# EAGLE design sensor_interface_1.1.0 (EAGLE 8.1.1)
DESCRIPTION: microOBD 200 OBD-II Module; HW_REV: 1.4; PCB_REV: C; PCB_SPEC1: Layer Count: 4; PCB_SPEC2: Size: 1.3" x 0.59"; PCB_SPEC3: Finish Thickness: 0.049" - 0.052"; PCB_SPEC4: Copper Weight: 1oz; TITLE: STM1120
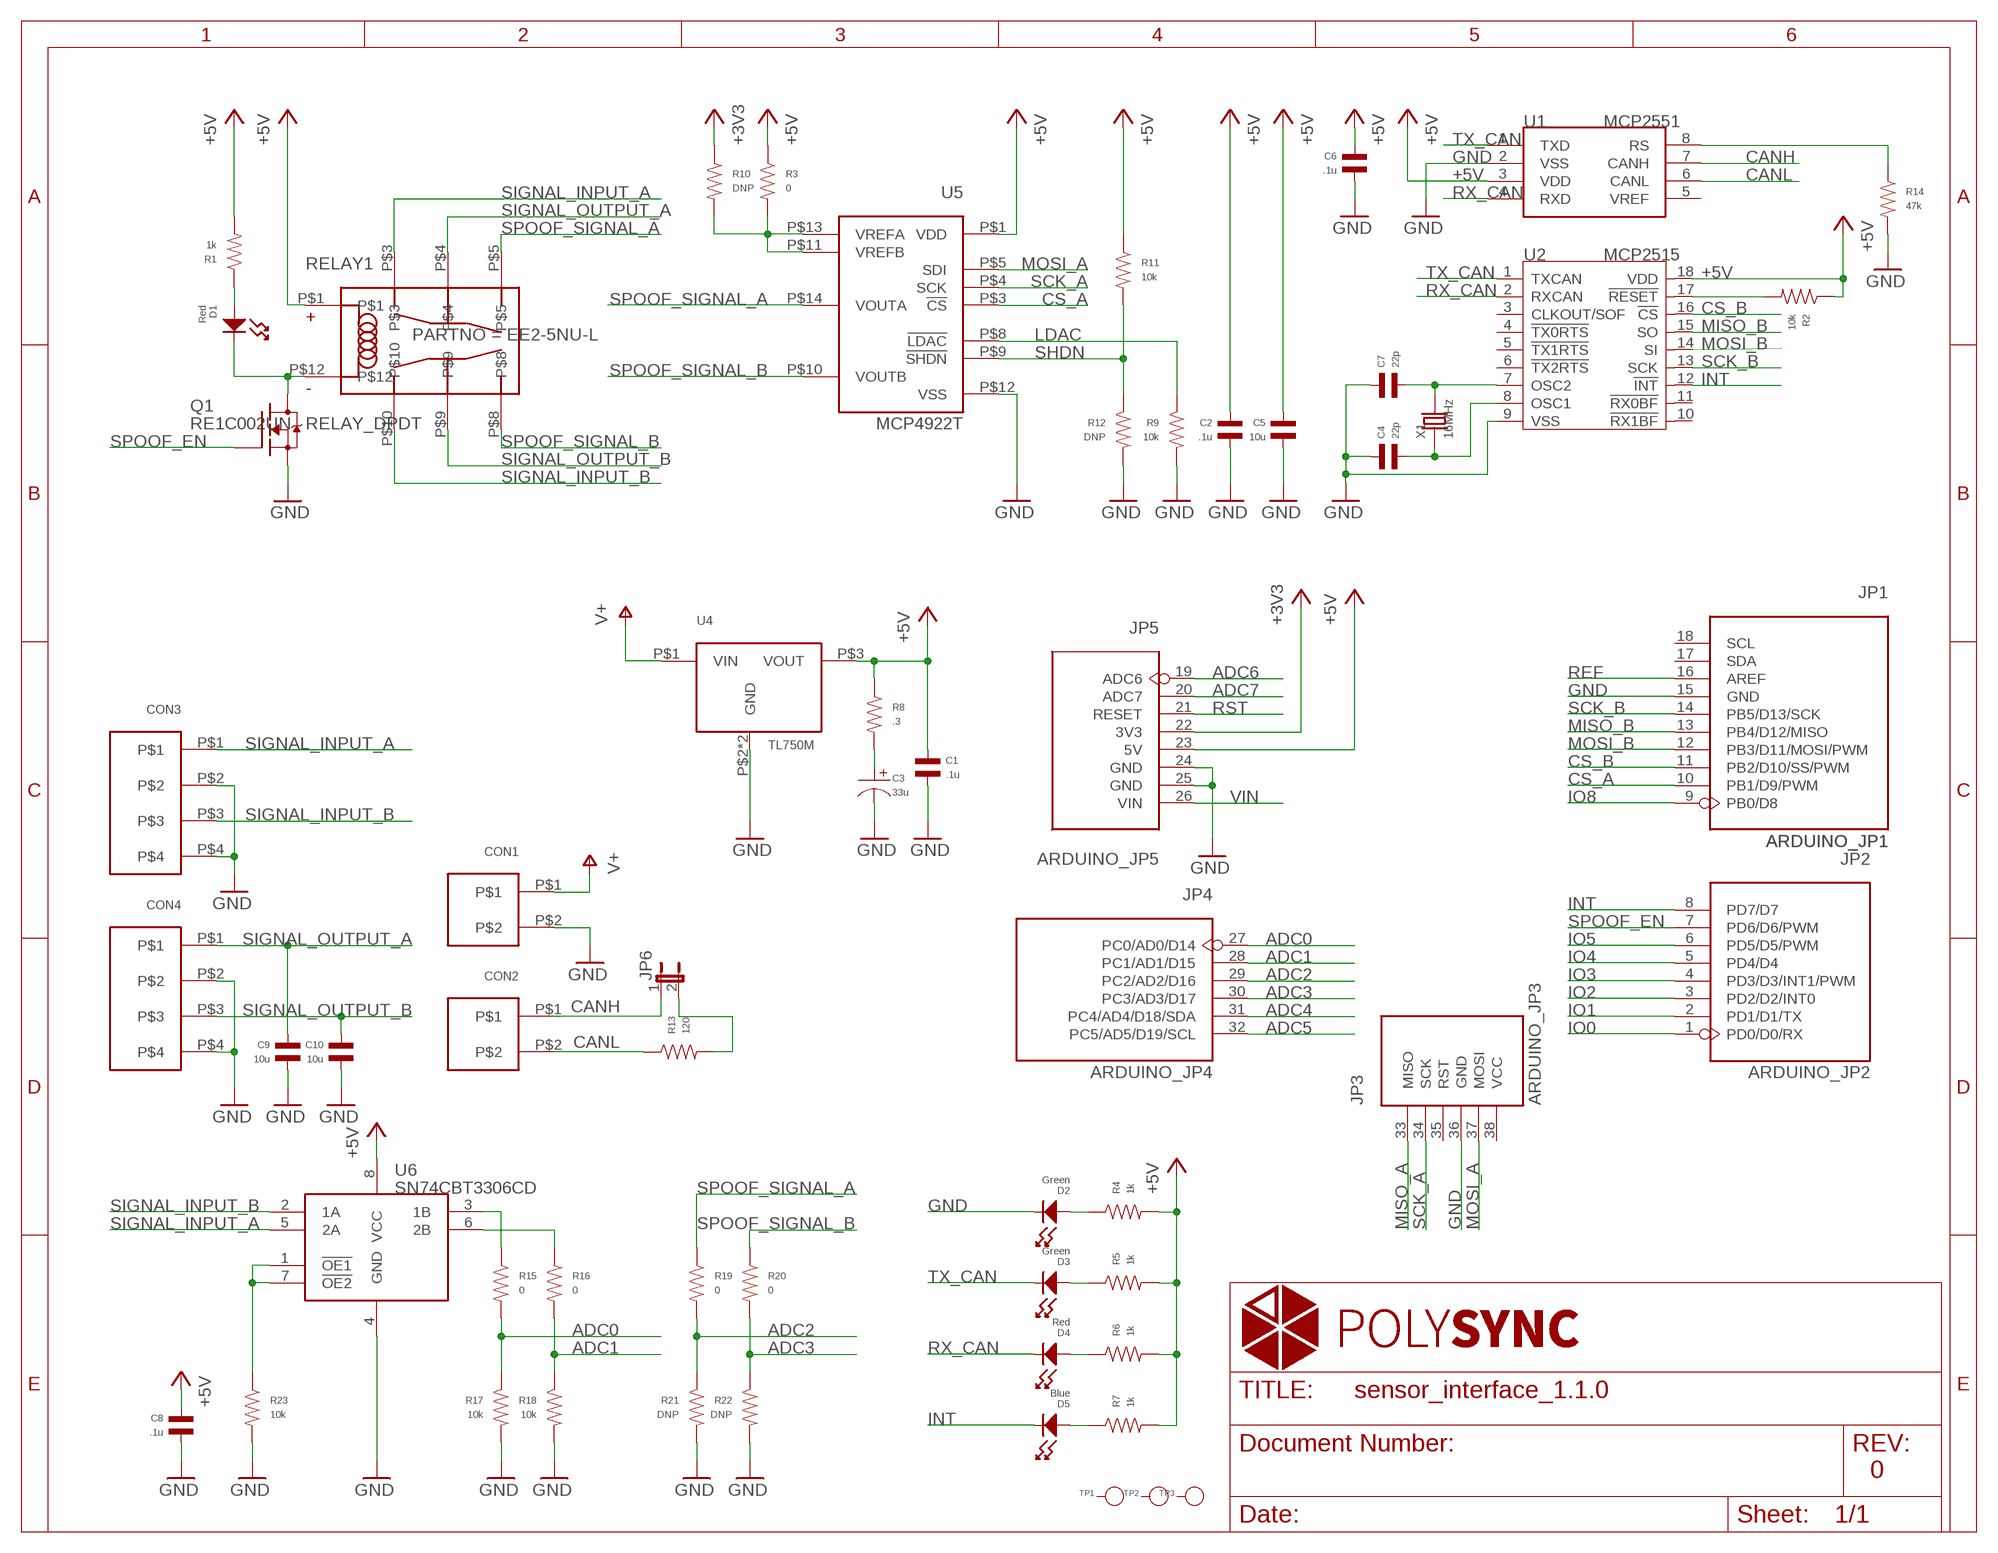
[diagram p0: schematic, sheet 1]

## Parts
C1  .1u  CAPACITOR_NP_0402  [C0402]
C2  .1u  CAPACITOR_NP_0402  [C0402]
C3  33u  CAPACITOR_P  [CP1206]
C4  22p  CAPACITOR_NP_0402  [C0402]
C5  10u  CAPACITOR_NP_0805  [C0805]
C6  .1u  CAPACITOR_NP_0402  [C0402]
C7  22p  CAPACITOR_NP_0402  [C0402]
C8  .1u  CAPACITOR_NP_0402  [C0402]
C9  10u  CAPACITOR_NP_0805  [C0805]
C10  10u  CAPACITOR_NP_0805  [C0805]
CON1  CON23.5MM  [PHOENIX_2_45]
CON2  CON23.5MM  [PHOENIX_2_45]
CON3  CON4  [PHOENIX_4_45]
CON4  CON4  [PHOENIX_4_45]
D1  Red  LED_SINGLE-0603  [LED0603]
D2  Green  LED_SINGLE-0603  [LED0603]
D3  Green  LED_SINGLE-0603  [LED0603]
D4  Red  LED_SINGLE-0603  [LED0603]
D5  Blue  LED_SINGLE-0603  [LED0603]
JP1  ARDUINO_JP1  [ARDUINO_JP1]
JP2  ARDUINO_JP2  [ARDUINO_JP2]
JP3  ARDUINO_JP3  [ARDUINO_JP3]
JP4  ARDUINO_JP4  [ARDUINO_JP4]
JP5  ARDUINO_JP5  [ARDUINO_JP5]
JP6  JP1E  [JP1]
Q1  RE1C002UN  [EMT3F]
R1  1k  RESISTOR_0402  [R0402]
R2  10k  RESISTOR_0402  [R0402]
R3  0  RESISTOR_0402  [R0402]
R4  1k  RESISTOR_0402  [R0402]
R5  1k  RESISTOR_0402  [R0402]
R6  1k  RESISTOR_0402  [R0402]
R7  1k  RESISTOR_0402  [R0402]
R8  .3  RESISTOR_0402  [R0402]
R9  10k  RESISTOR_0402  [R0402]
R10  DNP  RESISTOR_0402  [R0402]
R11  10k  RESISTOR_0402  [R0402]
R12  DNP  RESISTOR_0402  [R0402]
R13  120  RESISTOR_0402  [R0402]
R14  47k  RESISTOR_0402  [R0402]
R15  0  RESISTOR_0402  [R0402]
R16  0  RESISTOR_0402  [R0402]
R17  10k  RESISTOR_0402  [R0402]
R18  10k  RESISTOR_0402  [R0402]
R19  0  RESISTOR_0402  [R0402]
R20  0  RESISTOR_0402  [R0402]
R21  DNP  RESISTOR_0402  [R0402]
R22  DNP  RESISTOR_0402  [R0402]
R23  10k  RESISTOR_0402  [R0402]
RELAY1  RELAY_DPDT  [KEMET_EE2]
TP1  PAD-TEST-POINT'4545'  [TP_4545]
TP2  PAD-TEST-POINT'4545'  [TP_4545]
TP3  PAD-TEST-POINT'4545'  [TP_4545]
U1  MCP2551  MCP2551-SOIC8  [SOIC8-6.0]
U2  MCP2515  MCP2515-SOIC18  [SOIC18]
U4  TL750M  [TO-263]
U5  MCP4922T  [TSSOP-14]
U6  SN74CBT3306CD  [SOIC-8]
X1  16MHz  CRYSTAL-HC49UP  [HC49UP]

## Nets
+3V3: JP5.22(3V3) R10.P$1
+5V: C1.P$1 C2.P$1 C5.P$1 C6.P$1 C8.P$1 JP5.23(5V) R1.P$2 R2.P$1 R3.P$1 R4.P$2 R5.P$2 R6.P$2 R7.P$2 R8.P$1 R11.P$1 RELAY1.P$1 U1.3(VDD) U2.18(VDD) U4.P$3(VOUT) U5.P$1(VDD) U6.8(VCC)
ADC0: JP4.27(PC0/AD0/D14) R15.P$2 R17.P$1
ADC1: JP4.28(PC1/AD1/D15) R16.P$2 R18.P$1
ADC2: JP4.29(PC2/AD2/D16) R19.P$2 R21.P$1
ADC3: JP4.30(PC3/AD3/D17) R20.P$2 R22.P$1
ADC4: JP4.31(PC4/AD4/D18/SDA)
ADC5: JP4.32(PC5/AD5/D19/SCL)
ADC6: JP5.19(ADC6)
ADC7: JP5.20(ADC7)
CANH: CON2.P$1 JP6.1 U1.7(CANH)
CANL: CON2.P$2 R13.P$1 U1.6(CANL)
CS_A: JP1.10(PB1/D9/PWM) U5.P$3(!CS)
CS_B: JP1.11(PB2/D10/SS/PWM) U2.16(!CS)
GND: C1.P$2 C2.P$2 C3.P$2 C4.P$1 C5.P$2 C6.P$2 C7.P$1 C8.P$2 C9.P$2 C10.P$2 CON1.P$2 CON3.P$2 CON3.P$4 CON4.P$2 CON4.P$4 D2.CATHODE JP1.15(GND) JP3.36(GND) JP5.24(GND) JP5.25(GND) Q1.P$2(S) R9.P$2 R12.P$2 R14.P$2 R17.P$2 R18.P$2 R21.P$2 R22.P$2 R23.P$2 U1.2(VSS) U2.9(VSS) U4.P$2(GND) U4.P$4(GND) U5.P$12(VSS) U6.4(GND)
INT: D5.CATHODE JP2.8(PD7/D7) U2.12(!INT)
IO0: JP2.1(PD0/D0/RX)
IO1: JP2.2(PD1/D1/TX)
IO2: JP2.3(PD2/D2/INT0)
IO3: JP2.4(PD3/D3/INT1/PWM)
IO4: JP2.5(PD4/D4)
IO5: JP2.6(PD5/D5/PWM)
IO8: JP1.9(PB0/D8)
LDAC: R9.P$1 U5.P$8(!LDAC)
MISO_A: JP3.33(MISO)
MISO_B: JP1.13(PB4/D12/MISO) U2.15(SO)
MOSI_A: JP3.37(MOSI) U5.P$5(SDI)
MOSI_B: JP1.12(PB3/D11/MOSI/PWM) U2.14(SI)
N$1: D3.ANODE R5.P$1
N$2: JP6.2 R13.P$2
N$3: D1.CATHODE Q1.P$3(D) RELAY1.P$12
N$4: C3.P$1 R8.P$2
N$5: D4.ANODE R6.P$1
N$6: D2.ANODE R4.P$1
N$7: R3.P$2 R10.P$2 U5.P$11(VREFB) U5.P$13(VREFA)
N$8: D5.ANODE R7.P$1
N$9: R14.P$1 U1.8(RS)
N$10: D1.ANODE R1.P$1
N$11: R23.P$1 U6.1(!OE1) U6.7(!OE2)
N$12: R16.P$1 U6.6(2B)
N$13: R15.P$1 U6.3(1B)
N$16: C7.P$2 U2.7(OSC2) X1.2
N$17: C4.P$2 U2.8(OSC1) X1.1
REF: JP1.16(AREF)
RST: JP5.21(RESET)
RST_N: R2.P$2 U2.17(!RESET)
RX_CAN: D4.CATHODE U1.4(RXD) U2.2(RXCAN)
SCK_A: JP3.34(SCK) U5.P$4(SCK)
SCK_B: JP1.14(PB5/D13/SCK) U2.13(SCK)
SHDN: R11.P$2 R12.P$1 U5.P$9(!SHDN)
SIGNAL_INPUT_A: CON3.P$1 RELAY1.P$3 U6.5(2A)
SIGNAL_INPUT_B: CON3.P$3 RELAY1.P$10 U6.2(1A)
SIGNAL_OUTPUT_A: C9.P$1 CON4.P$1 RELAY1.P$4
SIGNAL_OUTPUT_B: C10.P$1 CON4.P$3 RELAY1.P$9
SPOOF_EN: JP2.7(PD6/D6/PWM) Q1.P$1(G)
SPOOF_SIGNAL_A: R19.P$1 RELAY1.P$5 U5.P$14(VOUTA)
SPOOF_SIGNAL_B: R20.P$1 RELAY1.P$8 U5.P$10(VOUTB)
TX_CAN: D3.CATHODE U1.1(TXD) U2.1(TXCAN)
V+: CON1.P$1 U4.P$1(VIN)
VIN: JP5.26(VIN)
Unconnected: JP1.17(SDA) JP1.18(SCL) JP3.35(RST) JP3.38(VCC) TP1.T TP2.T TP3.T U1.5(VREF) U2.3(CLKOUT/SOF) U2.4(!TX0RTS) U2.5(!TX1RTS) U2.6(!TX2RTS) U2.10(!RX1BF) U2.11(!RX0BF)

## Notes on the sheet
- 0

## Library data of the parts
C1 C2 C4-C10 = MF_Passives:CAPACITOR_NP: Library: MF_Passives Description: Device for Non-Polarized Capacitors. Manufacture part number (MPN) can be added via Attributes. Check https://factory.macrofab.com/parts for the house parts list.; POPULATE: 1
C3 = MF_Passives:CAPACITOR_P: Library: MF_Passives Description: Device for Polarized Capacitors. Manufacture part number (MPN), Voltage Rating, and Tolerance can be added via Attributes. Check https://factory.macrofab.com/parts for the house parts list.
CON1 CON2 = polysync:CON2
CON3 CON4 = polysync:CON4
D1-D5 = MF_LEDs:LED_SINGLE: Library: MF_LEDs Description: Device for Single LED Packages. Manufacture part number (MFG#) can be added via Attributes.; HOUSEPART: NO; POPULATE: 1
JP1 = polysync_steering_throttle:ARDUINO_JP1
JP2 = polysync_steering_throttle:ARDUINO_JP2
JP3 = polysync_steering_throttle:ARDUINO_JP3
JP4 = polysync_steering_throttle:ARDUINO_JP4
JP5 = polysync_steering_throttle:ARDUINO_JP5
JP6 = jumper:JP1E: JUMPER
Q1 = BTLE_widget:RE1C002UN
R1-R23 = MF_Passives:RESISTOR: Library: MF_Passives Description: Device for Resistors. Manufacture part number (MPN), Voltage, Tolerance, and Wattage Rating can be added via Attributes. Check https://factory.macrofab.com/parts for the house parts list.; POPULATE: 1
RELAY1 = polysync:RELAY_DPDT; PARTNO: EE2-5NU-L
TP1-TP3 = Discrete:PAD-TEST-POINT; PARTNO: DNP
U1 = IC:MCP2551: High-Speed CAN Transceiver http://ww1.microchip.com/downloads/en/devicedoc/21667f.pdf
U2 = IC:MCP2515: Stand-Alone CAN Controller With SPI Interface
U4 = polysync:TL750M
U5 = polysync:MCP4922T
U6 = polysync:SN74CBT3306CD
X1 = Discrete:CRYSTAL*: CRYSTAL

## Net classes
0 default: width 0.152 mm, drill 0.305 mm, clearance 0.152 mm

## Board
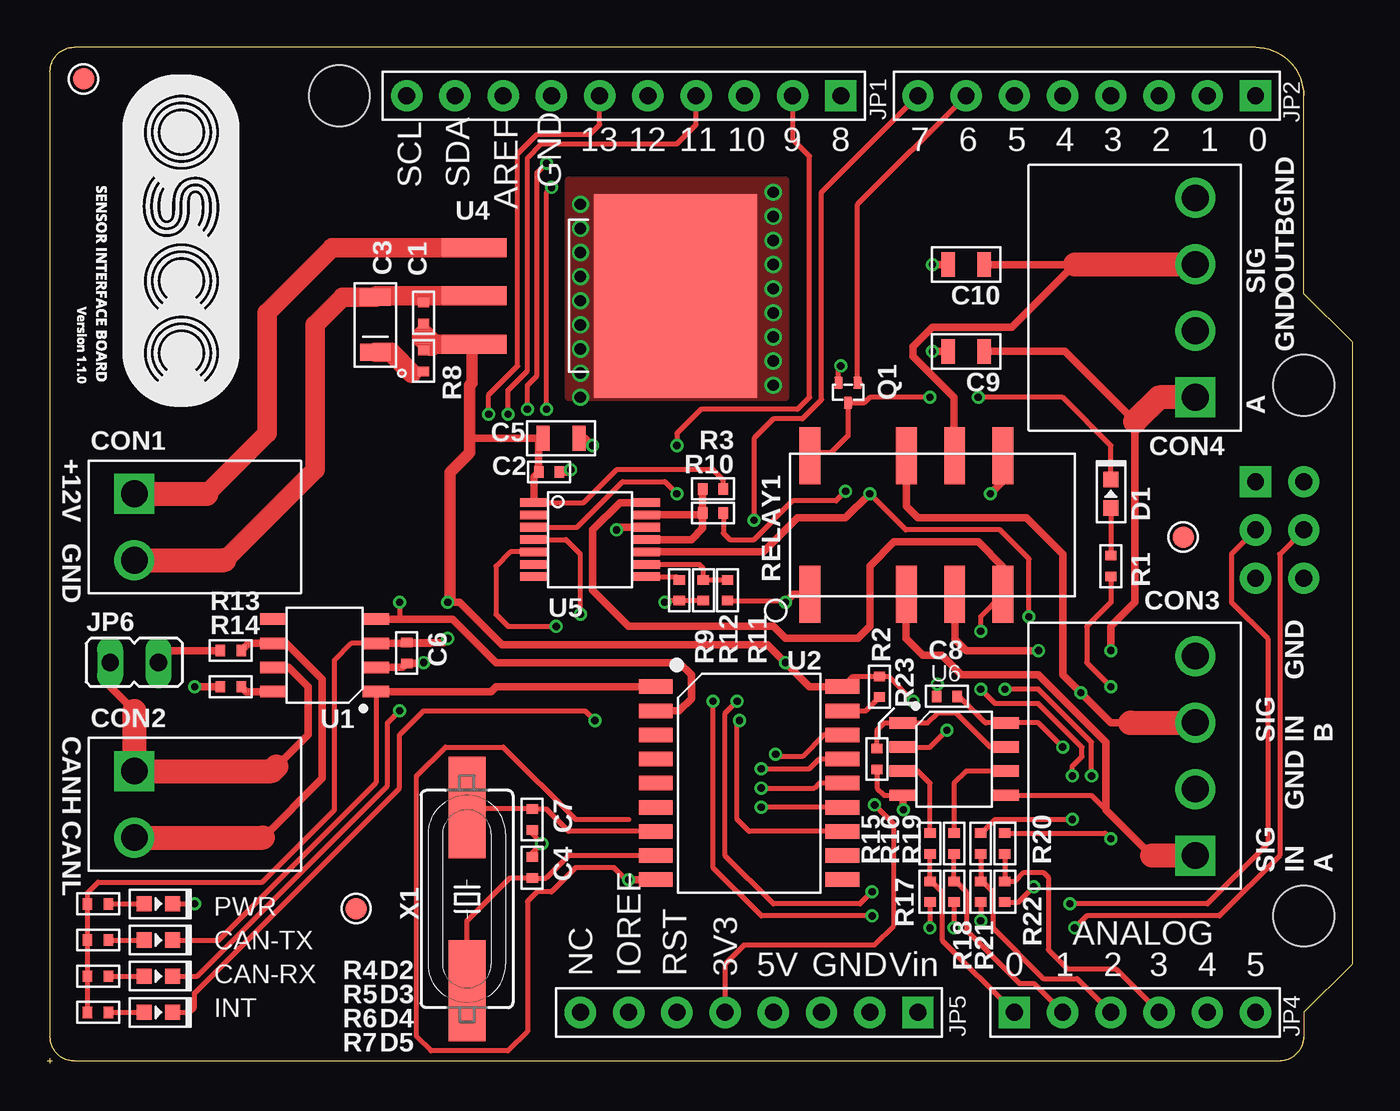
[diagram p1: board, top side]
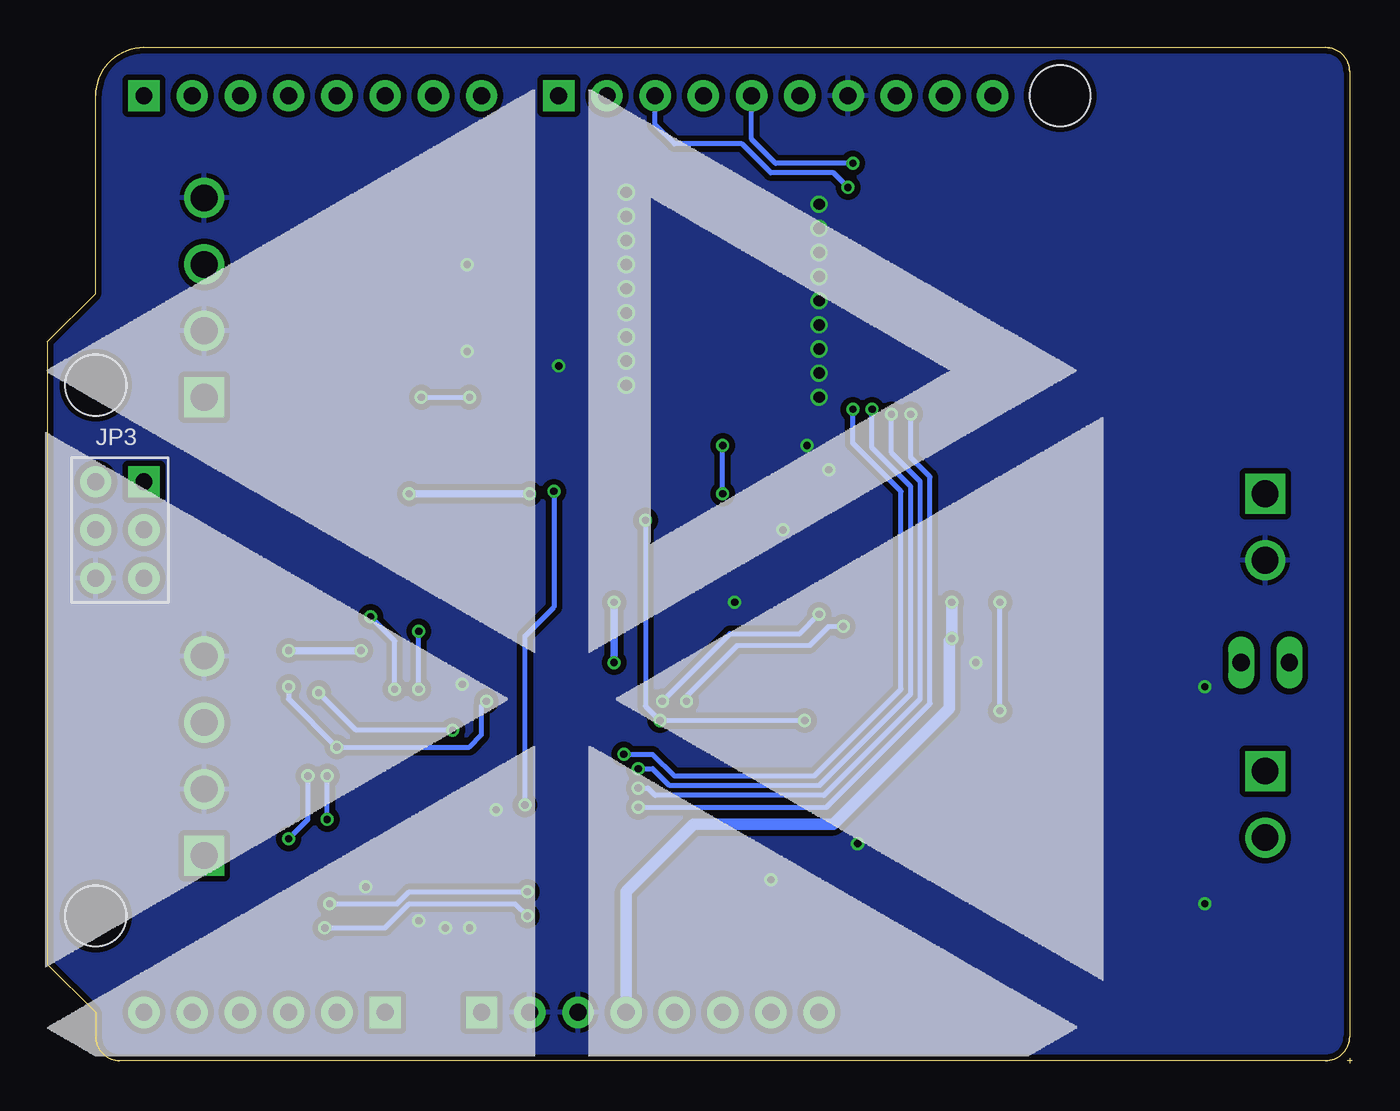
[diagram p2: board, bottom side, seen from below]

Size 68.71 x 53.47 mm. Coordinates in mm from the lower left corner, seen from the top.
Outline: 66.17,1.4 arc-90 64.9,0.13
Outline: 1.4,0.13 arc-90 0.13,1.4
Outline: 0.13,52.2 arc-90 1.4,53.47
Outline: 63.63,53.47 arc-90 66.17,50.93
Outline: 0.13,1.4 arc90 1.4,0.13
Outline: 64.9,0.13 arc90 66.17,1.4
Outline: 1.4,53.47 arc90 0.13,52.2
Outline: 0.13,1.4 arc90 1.4,0.13
Outline: 64.9,0.13 arc90 66.17,1.4
Outline: 66.17,50.93 arc90 63.63,53.47
Outline: 66.17,1.4 66.17,2.67 68.71,5.21 68.71,37.97 66.17,40.51 66.17,50.93
Outline: 66.17,1.4 arc-90 64.9,0.13
Outline: 63.63,53.47 1.4,53.47
Outline: 1.4,53.47 arc90 0.13,52.2
Outline: 0.13,52.2 0.13,1.4
Outline: 0.13,1.4 arc90 1.4,0.13
Outline: 66.17,50.93 arc90 63.63,53.47
Outline: 1.4,0.13 64.9,0.13
Outline: 0,0.13 0.25,0.13
Outline: 0.13,0.25 0.13,0
Copper layers (1*16): Top 0.035mm / dielectric 1.5mm / Bottom 0.035mm
Design rules "MF_Standard_2_Layer": minimum track width 6mil, minimum drill 12mil, track to track 6mil, track to pad 6mil, pad to pad 6mil, via to via 6mil, smd to smd 0mil, copper to edge 10mil, drill to drill 10mil, minimum pad ring 6mil, minimum via ring 6mil, stop-mask expansion 2mil, vias tented up to drill 25mil, thermal gap 10mil

### Footprints (pad centres in the part's own frame; a part is rotated, then mirrored left to right if it is on the bottom)
C0402 = smd 0.5 x 0.6: P$1 -0.55,0; P$2 0.55,0
CP1206 = smd 0.9 x 1.6: P$1 -1.45,0; P$2 1.45,0
C0805 = smd 0.7 x 1.3: P$1 -0.95,0; P$2 0.95,0
PHOENIX_2_45 = drill 1.4 square: P$1 0,0 | drill 1.4: P$2 3.5,0
PHOENIX_4_45 = drill 1.4 square: P$1 0,0 | drill 1.4: P$2 3.5,0; P$3 7,0; P$4 10.5,0
LED0603 = smd 0.8 x 0.8: ANODE 0.75,0; CATHODE -0.75,0
ARDUINO_JP1 = drill 0.889 pad 1.651 square: 9 41.656,50.8 | drill 0.889 pad 1.651: 10 39.116,50.8; 11 36.576,50.8; 12 34.036,50.8; 13 31.496,50.8; 14 28.956,50.8; 15 26.416,50.8; 16 23.876,50.8; 17 21.336,50.8; 18 18.796,50.8 | hole 3.2: 15.24,50.8
ARDUINO_JP2 = drill 0.889 pad 1.651 square: 1 63.5,50.8 | drill 0.889 pad 1.651: 2 60.96,50.8; 3 58.42,50.8; 4 55.88,50.8; 5 53.34,50.8; 6 50.8,50.8; 7 48.26,50.8; 8 45.72,50.8
ARDUINO_JP3 = drill 0.889 pad 1.651 square: 33 63.5,30.48 | drill 0.889 pad 1.651: 34 63.5,27.94; 35 63.5,25.4; 36 66.04,25.4; 37 66.04,27.94; 38 66.04,30.48 | hole 3.2: 66.04,35.56; 66.04,7.62
ARDUINO_JP4 = drill 0.889 pad 1.651 square: 27 50.8,2.54 | drill 0.889 pad 1.651: 28 53.34,2.54; 29 55.88,2.54; 30 58.42,2.54; 31 60.96,2.54; 32 63.5,2.54
ARDUINO_JP5 = drill 0.889 pad 1.651: 19 27.94,2.54; 20 30.48,2.54; 21 33.02,2.54; 22 35.56,2.54; 23 38.1,2.54; 24 40.64,2.54; 25 43.18,2.54 | drill 0.889 pad 1.651 square: 26 45.72,2.54
JP1 = drill 0.914 long: 1 0,-1.27; 2 0,1.27
EMT3F = smd 0.46 x 0.65: P$1 -0.5,0; P$2 0.5,0; P$3 0,1.05
R0402 = smd 0.5 x 0.6: P$1 -0.55,0; P$2 0.55,0
KEMET_EE2 = smd 1.1 x 3: P$1 -6.45,-3.645; P$3 -1.37,-3.645; P$4 1.17,-3.645; P$5 3.71,-3.645; P$8 3.71,3.645; P$9 1.17,3.645; P$10 -1.37,3.645; P$12 -6.45,3.645
TP_4545 = smd 1.143 x 1.143: T 0,0
SOIC8-6.0 = smd 0.6 x 1.4: 1 -1.905,-2.7; 2 -0.635,-2.7; 3 0.635,-2.7; 4 1.905,-2.7; 5 1.905,2.7; 6 0.635,2.7; 7 -0.635,2.7; 8 -1.905,2.7
SOIC18 = smd 0.762 x 1.778: 1 -5.08,-4.915; 2 -3.81,-4.915; 3 -2.54,-4.915; 4 -1.27,-4.915; 5 0,-4.915; 6 1.27,-4.915; 7 2.54,-4.915; 8 3.81,-4.915; 9 5.08,-4.915; 10 5.08,4.915; 11 3.81,4.915; 12 2.54,4.915; 13 1.27,4.915; 14 0,4.915; 15 -1.27,4.915; 16 -2.54,4.915; 17 -3.81,4.915; 18 -5.08,4.915
TO-263 = smd 1 x 3.4: P$1 -2.54,0; P$2 0,0; P$3 2.54,0 | smd 10.7 x 8.6: P$4 0,10.6
TSSOP-14 = smd 1.45 x 0.45: P$1 -2.95,1.95; P$2 -2.95,1.3; P$3 -2.95,0.65; P$4 -2.95,0; P$5 -2.95,-0.65; P$6 -2.95,-1.3; P$7 -2.95,-1.95; P$8 2.95,-1.95; P$9 2.95,-1.3; P$10 2.95,-0.65; P$11 2.95,0; P$12 2.95,0.65; P$13 2.95,1.3; P$14 2.95,1.95
SOIC-8 = smd 0.6 x 1.4: 1 -1.905,-2.7; 2 -0.635,-2.7; 3 0.635,-2.7; 4 1.905,-2.7; 5 1.905,2.7; 6 0.635,2.7; 7 -0.635,2.7; 8 -1.905,2.7
HC49UP = smd 5.334 x 1.93: 1 -4.826,0; 2 4.826,0

### Placement (x,y rotation side)
C1  19.81,39.5 90 top
C2  26.42,31.11 0 top
C3  17.27,38.86 90 top
C4  25.53,10.29 270 top
C5  27.05,32.89 0 top
C6  18.92,21.59 270 top
C7  25.53,12.83 90 top
C8  47.37,19.3 180 top
C9  48.39,37.47 180 top
C10  48.39,42.04 180 top
CON1  4.57,29.97 270 top
CON2  4.57,15.37 270 top
CON3  60.45,10.92 90 top
CON4  60.45,35.05 90 top
D1  56.01,29.97 270 top
D2  5.84,8.38 180 top
D3  5.84,6.48 180 top
D4  5.84,4.57 180 top
D5  5.84,2.67 180 top
JP1  0.13,0.13 0 top
JP2  0.13,0.13 0 top
JP3  0.13,0.13 0 top
JP4  0.13,0.13 0 top
JP5  0.13,0.13 0 top
JP6  4.57,21.08 270 top
Q1  42.16,35.81 180 top
R1  56.01,26.16 270 top
R2  43.82,19.81 270 top
R3  35.05,30.23 180 top
R4  2.67,8.38 180 top
R5  2.67,6.48 180 top
R6  2.67,4.57 180 top
R7  2.67,2.67 180 top
R8  19.81,36.96 270 top
R9  33.27,24.89 270 top
R10  35.05,28.96 180 top
R11  35.81,24.89 90 top
R12  34.54,24.89 270 top
R13  9.65,21.72 180 top
R14  9.65,19.81 180 top
R15  46.48,11.56 270 top
R16  47.75,11.56 270 top
R17  46.48,9.02 270 top
R18  47.75,9.02 270 top
R19  49.15,11.56 270 top
R20  50.42,11.56 270 top
R21  49.15,9.02 270 top
R22  50.42,9.02 270 top
R23  43.69,16 270 top
RELAY1  46.61,28.32 0 top
TP1  16.26,8.13 0 top
TP2  59.82,27.69 0 top
TP3  1.91,51.82 0 top
U1  14.61,21.46 90 top
U2  36.96,14.73 270 top
U4  22.48,40.39 270 top
U5  28.57,27.56 0 top
U6  47.75,16 270 top
U$1  [POLYSYNC_STEERING_BOT]  0.64,0.38 0 top
U$2  [POLYSYNC_SENSOR_1_1_0]  0.38,52.2 270 top
X1  22.1,8.64 90 top

### Tracks (layer width: path | path; a pad name or v marks a point on that pad's centre or on a via)
+3V3  (via drill 0.38)
  Top 0.254: v42.04,30.1 41.53,29.59 39.24,29.59 37.21,27.56 35.94,27.56 35.6,27.9 R10.P$1 | JP5.22 35.69,5.21 36.7,6.22 43.56,6.22 44.58,7.24 44.58,12.57 v43.56,13.59
  Bottom 0.254: v42.04,30.1 42.04,24 43.56,22.48 v43.56,13.59
+5V  (via drill 0.38)
  Top 0.254: C1.P$1 19.81,38.23 | R8.P$1 19.85,37.51 20.19,37.85 | R7.P$2 R6.P$2 R5.P$2 R4.P$2 2.12,8.98 2.67,9.53 11.3,9.53 15.11,13.34 15.11,21.21 16,22.1 U1.3 | R1.P$2 56.01,24.26 54.74,22.99 54.74,21.08 v56.01,19.81 | R3.P$1 35.6,30.69 35.05,31.24 29.97,31.24 28.24,29.51 U5.P$1 | R11.P$1 38.78,24.34 v38.86,24.26 | U2.18 42.42,20.36 R2.P$1 44.28,20.36 v45.59,19.05 | v53.47,16.64 52.2,17.91 U6.8 49.4,17.91 48.01,19.3 C8.P$1
  Top 0.406: U1.3 20.15,22.1 C6.P$1 20.87,22.14 v21.08,22.35 | 22.35,37.72 U4.P$3 | 22.22,32.89 C5.P$1 25.87,32.66 C2.P$1 25.62,30.87 U5.P$1 | v21.08,24.26 21.72,24.26 23.94,22.03 37.91,22.03 v38.86,21.08 40.13,19.81 U2.18 | RELAY1.P$1 39.28,24.68 v38.86,24.26
  Top 0.61: 22.35,37.72 22.35,35.81 22.22,35.69 22.22,32.89 22.22,32.13 21.21,31.11 21.21,24.38 v21.08,24.26
  Top 1.016: U4.P$3 20.19,37.85
  Top 1.27: 20.19,37.85 19.81,38.23
  Bottom 0.254: v56.01,19.81 56.01,19.18 v53.47,16.64 46.48,16.64 45.85,17.27 45.85,18.8 v45.59,19.05
  Bottom 0.406: v38.86,24.26 v38.86,21.08
  Bottom 0.61: JP5.23 38.23,9.02 34.67,12.57 27.3,12.57 21.21,18.67 21.21,22.22 v21.08,22.35 v21.08,24.26
ADC0
  Top 0.254: R15.P$2 R17.P$1 46.57,9.57 47.12,9.02 47.12,6.48 JP4.27
ADC1
  Top 0.254: R16.P$2 R18.P$1 47.84,9.57 48.39,9.02 48.39,6.98 51.18,4.19 51.94,4.19 JP4.28
ADC2
  Top 0.254: JP4.29 54.23,4.44 52.45,4.44 49.78,7.11 49.78,9.02 49.23,9.57 R21.P$1 R19.P$2
ADC3
  Top 0.254: R20.P$2 R22.P$1 50.97,9.57 51.44,10.03 52.45,10.03 52.71,9.78 52.71,5.97 53.72,4.95 56.26,4.95 JP4.30
CANH
  Top 0.406: U1.7 12.7,20.83 13.72,19.81 13.72,17.27 12.07,15.62 11.81,15.37 | JP6.1 3.3,19.81 4.57,18.54
  Top 1.27: 12.07,15.62 11.81,15.37 CON2.P$1 4.57,18.54
CANL
  Top 0.406: 11.36,11.87 14.48,14.99 14.48,20.19 12.57,22.1 U1.6 10.58,22.1 R13.P$1
  Top 1.27: CON2.P$2 11.36,11.87
CS_A  (via drill 0.38)
  Top 0.254: U5.P$3 27.89,28.21 30.29,30.61 32.51,30.61 v33.15,29.97 | JP1.10 39.24,48.64 40.13,47.75 40.13,35.05 39.5,34.42 34.42,34.42 33.15,33.15 v33.15,32.51
  Bottom 0.254: v33.15,29.97 v33.15,32.51
CS_B  (via drill 0.38)
  Top 0.254: v26.29,34.42 26.29,45.85 v26.54,46.1 | U2.16 40.89,17.27 39.75,16.13 38.48,16.13 v38.35,16.26
  Bottom 0.254: v38.35,16.26 36.83,16.26 35.69,15.11 28.32,15.11 23.75,19.68 23.75,30.1 26.29,32.64 v26.29,34.42 | v26.54,46.1 27.3,46.86 30.61,46.86 32.13,48.39 35.69,48.39 36.7,49.4 JP1.11
GND  (via drill 0.38, 0.6)
  Top 0.254: C1.P$2 19.81,40.39 | D2.CATHODE v7.75,8.38 | v32.51,24.26 32.6,24.34 R9.P$2 R12.P$2 | R18.P$2 v47.75,7.11 | R17.P$2 v46.48,7.11 | 19.77,21.04 v19.81,21.08 | C7.P$1 25.53,12.07 v26.04,11.56 25.53,11.05 C4.P$1 | v30.61,9.65 30.48,9.65 29.84,10.29 27.81,10.29 26.54,9.02 25.78,9.02 25.27,8.51 25.27,1.65 24.26,0.64 20.19,0.64 19.43,1.4 19.43,15.11 20.95,16.64 24,16.64 27.81,12.83 30.61,12.83 | Q1.P$2 41.66,36.58 v41.78,36.7 | R21.P$2 v49.15,7.49 | R22.P$2 51.14,8.47 v51.94,9.27 | C8.P$2 46.82,19.9 v46.86,19.94 | R23.P$2 43.69,14.48 44.07,14.1 U6.4
  Top 0.406: R14.P$2 v7.75,19.81 | 19.77,21.04 C6.P$2 18.71,20.83 U1.2 | U2.9 v30.61,9.65 | U5.P$12 30.11,28.21 v29.97,28.07 | C2.P$2 27.43,31.11 v27.56,31.24 | C5.P$2 28.32,32.89 v28.7,32.51 | U6.4 45.05,13.37 v45.09,13.34 | C9.P$2 v46.61,37.47 | C10.P$2 v46.61,42.04
  Top 1.016: U4.P$2 19.81,40.39 17.35,40.39 C3.P$2 15.55,40.31 14.1,38.86 14.1,31.24 9.33,26.47
  Top 1.27: CON1.P$2 9.33,26.47
  other vias: 38.23,44.58 38.23,43.31 38.23,42.04 38.23,40.77 38.23,39.5 38.23,38.23 38.23,36.96 38.23,35.69 28.07,45.21 28.07,43.94 28.07,42.67 28.07,41.4 28.07,40.13 28.07,38.86 28.07,37.59 28.07,36.32 28.07,35.05 38.23,45.85
  pour Bottom (isolate 0.305): 0.13,53.47 0.13,0.13 68.71,0.13 68.71,53.47
  pour Top (no thermals): 27.43,46.48 27.43,35.05 38.86,35.05 38.86,46.48
INT  (via drill 0.38)
  Top 0.254: U2.12 36.96,12.19 36.32,12.83 36.32,17.91 v36.45,18.03 | v28.83,18.03 28.32,18.54 19.81,18.54 18.54,17.27 18.54,14.48 7.75,3.68 7.75,2.92 7.49,2.67 D5.CATHODE | v37.21,28.57 37.21,32.89 38.23,33.91 39.75,33.91 40.77,34.93 40.77,45.85 JP2.8
  Bottom 0.254: v28.83,18.03 v36.45,18.03 37.21,18.8 v37.21,28.57
LDAC
  Top 0.254: U5.P$8 33.11,25.61 R9.P$1
MISO_B  (via drill 0.38)
  Top 0.254: v37.59,15.49 40.13,15.49 40.64,16 U2.15 | v25.27,34.42 25.27,35.69 25.78,36.2 25.78,46.86 v26.29,47.37
  Bottom 0.254: v25.27,34.42 25.27,32.39 23.24,30.35 23.24,19.43 28.07,14.61 35.94,14.61 36.83,15.49 v37.59,15.49 | v26.29,47.37 30.35,47.37 31.62,48.64 JP1.13
MOSI_A  (via drill 0.38)
  Top 0.254: JP3.37 64.9,26.8 64.9,10.92 61.72,7.75 54.74,7.75 v54.1,7.11 | v43.43,7.75 37.59,7.75 35.05,10.29 v35.05,19.05 | U5.P$5 24.37,26.91 23.62,26.16 23.62,23.62 24.26,22.99 v26.8,22.99
  Bottom 0.254: v54.1,7.11 50.93,7.11 49.66,8.38 44.07,8.38 v43.43,7.75 | v26.8,22.99 27.56,22.99 28.57,21.97 32.39,21.97 35.05,19.3 v35.05,19.05
MOSI_B  (via drill 0.38)
  Top 0.254: v37.59,14.48 40.39,14.48 40.64,14.73 U2.14 | v24.26,34.16 24.26,35.43 25.27,36.45 25.27,47.62 26.04,48.39 33.15,48.39 34.16,49.4 JP1.12
  Bottom 0.254: v24.26,34.16 24.26,32.13 22.73,30.61 22.73,19.18 27.81,14.1 36.7,14.1 37.08,14.48 v37.59,14.48
N$1
  Top 0.254: R5.P$1 D3.ANODE
N$2
  Top 0.406: R13.P$2 6.48,21.72 JP6.2
N$3  (via drill 0.38)
  Top 0.254: 40.39,32.19 RELAY1.P$12 40.32,32.13 41.28,32.13 42.16,33.02 Q1.P$3 43.02,34.76 43.31,35.05 v46.48,35.05 | D1.CATHODE 56.01,32.51 53.47,35.05 v49.02,35.05
  Bottom 0.254: v49.02,35.05 v46.48,35.05
N$4
  Top 0.254: 19.18,36.32 19.73,36.32 R8.P$2
  Top 1.016: C3.P$1 18.09,37.41 19.18,36.32
N$5
  Top 0.254: R6.P$1 D4.ANODE
N$6
  Top 0.254: R4.P$1 D2.ANODE
N$7
  Top 0.406: U5.P$13 34.41,28.86 R10.P$2 | R10.P$2 R3.P$2 | U5.P$11 33.91,27.56 34.5,28.15 R10.P$2
N$8
  Top 0.254: R7.P$1 D5.ANODE
N$9
  Top 0.406: U1.8 10.46,19.56 R14.P$1
N$10
  Top 0.254: D1.ANODE R1.P$1
N$11
  Top 0.254: U6.7 49.66,16.64 47.88,18.41 46.86,18.41 46.36,17.91 U6.1 44.07,17.91 43.69,17.53 R23.P$1
N$12
  Top 0.254: U6.6 48.39,15.37 47.75,14.73 R16.P$1
N$13
  Top 0.254: R15.P$1 46.48,14.73 45.85,15.37 U6.3
N$16
  Top 0.254: U2.7 27.43,12.19 26.25,13.38 C7.P$2 22.18,13.38 X1.2
N$17
  Top 0.254: U2.8 27.43,10.92 26.25,9.74 C4.P$2 24.34,9.74 22.1,7.49 X1.1
RST_N
  Top 0.254: U2.17 43.1,18.54 R2.P$2
RX_CAN  (via drill 0.38)
  Top 0.254: v18.54,18.54 17.91,17.91 17.91,14.61 7.87,4.57 D4.CATHODE | v18.54,24.26 18.54,23.37
  Top 0.406: U2.2 33.27,18.54 33.91,19.18 33.91,20.45 33.27,21.08 23.62,21.08 21.34,23.37 18.54,23.37 U1.4
  Bottom 0.254: v18.54,18.54 v18.54,24.26
SCK_A  (via drill 0.38)
  Top 0.254: JP3.34 62.36,26.8 62.36,24.26 64.26,22.35 64.26,11.56 61.09,8.38 v53.85,8.38 | v43.43,9.02 42.8,8.38 38.23,8.38 35.69,10.92 35.69,18.41 v36.32,19.05 | U5.P$4 27.3,27.56 28.07,26.8 v28.07,23.62
  Bottom 0.254: v53.85,8.38 50.29,8.38 49.66,9.02 v43.43,9.02 | v28.07,23.62 29.08,22.61 32.77,22.61 v36.32,19.05
SCK_B  (via drill 0.38)
  Top 0.254: U2.13 v37.59,13.46 | v23.24,34.16 23.24,35.18 24.77,36.7 24.77,47.88 25.78,48.9 28.57,48.9 29.08,49.4 JP1.14
  Bottom 0.254: v37.59,13.46 27.69,13.46 22.22,18.92 22.22,30.86 23.24,31.88 v23.24,34.16
SHDN
  Top 0.254: U5.P$9 34.32,26.26 34.54,26.04 R12.P$1 R11.P$2
SIGNAL_INPUT_A
  Top 0.254: U6.5 54.99,14.1 55.75,13.34
  Top 0.406: RELAY1.P$3 45.21,24.65 45.21,22.35 46.1,21.46 47.12,21.46 48.13,20.45 52.2,20.45 55.75,16.89 55.75,13.34 58.17,10.92
  Top 1.27: CON3.P$1 58.17,10.92
SIGNAL_INPUT_B  (via drill 0.38)
  Top 0.254: U6.2 46.48,16.64 v47.37,17.53
  Top 0.406: RELAY1.P$10 45.24,29.31 45.85,28.7 51.56,28.7 53.47,26.8 53.47,20.45 v54.42,19.49 55.99,17.92 57.04,17.92
  Top 1.27: CON3.P$3 57.04,17.92 57.02,17.91
  Bottom 0.254: v47.37,17.53 52.45,17.53 v54.42,19.49
SIGNAL_OUTPUT_A  (via drill 0.38)
  Top 0.406: RELAY1.P$4 47.78,22.32 48.39,21.72 v52.2,21.72 | v56.01,21.72 56.01,22.99 57.28,24.26 57.28,33.78 53.59,37.47 C9.P$1
  Top 1.27: CON4.P$1 58.55,35.05 57.28,33.78
  Bottom 0.406: v56.01,21.72 v52.2,21.72
SIGNAL_OUTPUT_B
  Top 0.406: RELAY1.P$9 47.75,31.99 47.75,35.05 45.59,37.21 45.59,37.72 46.61,38.73 50.8,38.73 54.12,42.05 54.1,42.04 C10.P$1
  Top 1.27: 54.12,42.05 CON4.P$3
SPOOF_EN
  Top 0.254: 42.8,35.81 Q1.P$1 42.66,45.2 JP2.7
SPOOF_SIGNAL_A  (via drill 0.38)
  Top 0.254: v49.15,22.73 49.15,23.51 RELAY1.P$5 | R19.P$1 49.19,12.11 49.91,12.83 v53.98,12.83 | v53.98,15.11 53.98,15.62 54.48,16.13 54.48,16.64 52.2,18.92 49.91,18.92 v49.15,19.68
  Top 0.406: U5.P$14 30.14,29.51 28.7,28.07 28.7,24.89 30.61,22.99 38.23,22.99 38.86,22.35 42.67,22.35 43.31,22.99 43.31,26.16 44.58,27.43 49.02,27.43 50.32,26.13 RELAY1.P$5
  Bottom 0.254: v49.15,19.68 v49.15,22.73 | v53.98,12.83 v53.98,15.11
SPOOF_SIGNAL_B  (via drill 0.38)
  Top 0.254: v51.69,23.49 51.69,26.54 50.16,28.07 45.21,28.07 v43.31,29.97 | R20.P$1 55.71,12.11 v56.01,11.81 | v54.99,15.11 54.99,16.89 52.2,19.68 v50.42,19.68
  Top 0.406: U5.P$10 37.7,26.91 39.5,28.7 42.04,28.7 v43.31,29.97 | RELAY1.P$8 50.32,30.63 v49.66,29.97
  Bottom 0.254: v50.42,19.68 50.42,22.22 v51.69,23.49 | v56.01,11.81 54.99,12.83 v54.99,15.11
  Bottom 0.406: v43.31,29.97 v49.66,29.97
TX_CAN
  Top 0.254: D3.CATHODE 9.02,6.48 17.3,14.77 U1.1
  Top 0.406: U1.1 23.37,19.56 23.62,19.81 U2.1
V+
  Top 1.016: 8.38,29.97 11.56,33.15 11.56,39.5 14.99,42.93 U4.P$1
  Top 1.27: CON1.P$1 8.38,29.97

### Text on the board
tPlace: GND | SIG / OUTB | GND | A | +12V | GND | GND | CANH | SIG / IN / B | CANL | GND | SIG / IN / A | PWR | CAN-TX | CAN-RX | INT